# EasyEDA Pro project 轮腿PCB.eprj, schematic Schematic1
Board Name: 舵机电源板; Create Date: 2026-02-23
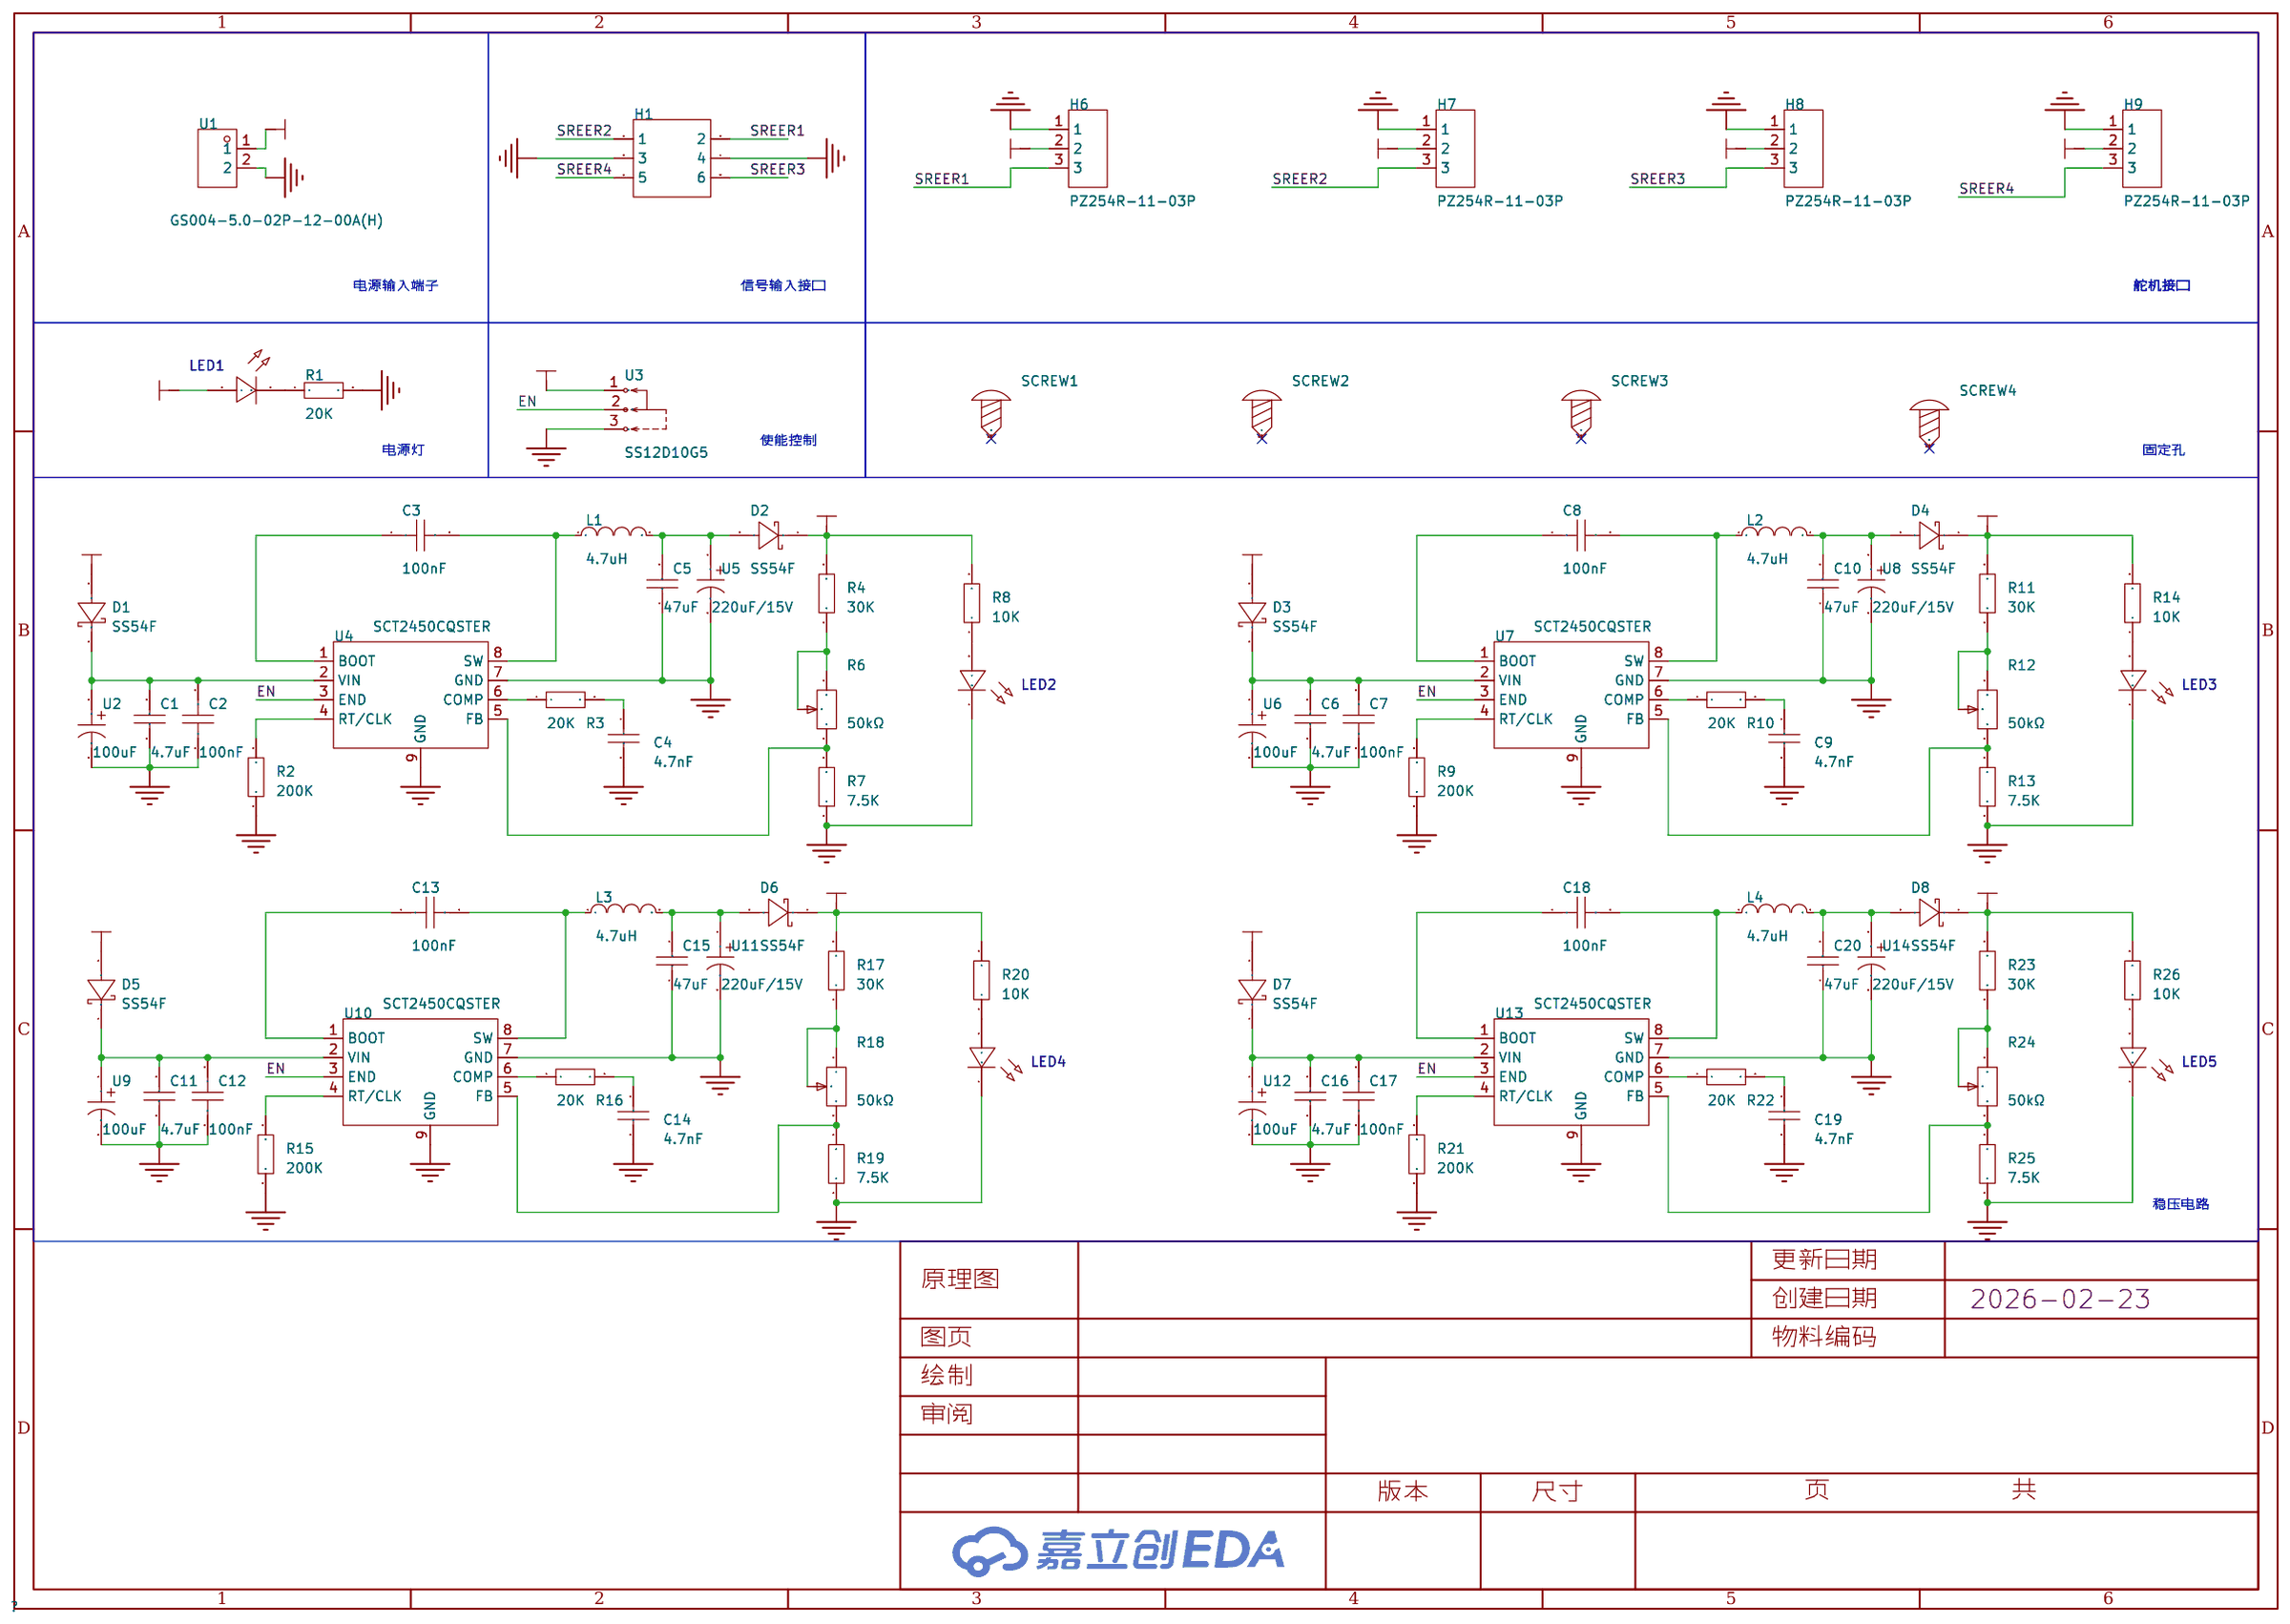
[diagram p0: schematic sheet]

## Parts
C1  4.7uF  [C1206]
C2  100nF  [C0603]
C3  100nF  [C0603]
C4  4.7nF  [C0603]
C5  47uF  [C0603]
C6  4.7uF  [C1206]
C7  100nF  [C0603]
C8  100nF  [C0603]
C9  4.7nF  [C0603]
C10  47uF  [C0603]
C11  4.7uF  [C1206]
C12  100nF  [C0603]
C13  100nF  [C0603]
C14  4.7nF  [C0603]
C15  47uF  [C0603]
C16  4.7uF  [C1206]
C17  100nF  [C0603]
C18  100nF  [C0603]
C19  4.7nF  [C0603]
C20  47uF  [C0603]
D1  SS54F  [SMAF_L3.5-W2.6-LS4.7-RD-1]
D2  SS54F  [SMAF_L3.5-W2.6-LS4.7-RD-1]
D3  SS54F  [SMAF_L3.5-W2.6-LS4.7-RD-1]
D4  SS54F  [SMAF_L3.5-W2.6-LS4.7-RD-1]
D5  SS54F  [SMAF_L3.5-W2.6-LS4.7-RD-1]
D6  SS54F  [SMAF_L3.5-W2.6-LS4.7-RD-1]
D7  SS54F  [SMAF_L3.5-W2.6-LS4.7-RD-1]
D8  SS54F  [SMAF_L3.5-W2.6-LS4.7-RD-1]
H1  -  [HDR-TH_6P-P2.54-V-R2-C3-S2.54_A2541WV-2X3P]
H6  PZ254R-11-03P  [HDR-TH_3P-P2.54-H-M-W10.4]
H7  PZ254R-11-03P  [HDR-TH_3P-P2.54-H-M-W10.4]
H8  PZ254R-11-03P  [HDR-TH_3P-P2.54-H-M-W10.4]
H9  PZ254R-11-03P  [HDR-TH_3P-P2.54-H-M-W10.4]
L1  4.7uH  [IND-SMD_L5.4-W5.2_FXL0530]
L2  4.7uH  [IND-SMD_L5.4-W5.2_FXL0530]
L3  4.7uH  [IND-SMD_L5.4-W5.2_FXL0530]
L4  4.7uH  [IND-SMD_L5.4-W5.2_FXL0530]
LED1  -  [LED_0603]
LED2  -  [LED_0603]
LED3  -  [LED_0603]
LED4  -  [LED_0603]
LED5  -  [LED_0603]
R1  20K  [R0603]
R2  200K  [R0603]
R3  20K  [R0603]
R4  30K  [R0603]
R6  50kΩ  [RES-ADJ-TH_3296W]
R7  7.5K  [R0603]
R8  10K  [R0603]
R9  200K  [R0603]
R10  20K  [R0603]
R11  30K  [R0603]
R12  50kΩ  [RES-ADJ-TH_3296W]
R13  7.5K  [R0603]
R14  10K  [R0603]
R15  200K  [R0603]
R16  20K  [R0603]
R17  30K  [R0603]
R18  50kΩ  [RES-ADJ-TH_3296W]
R19  7.5K  [R0603]
R20  10K  [R0603]
R21  200K  [R0603]
R22  20K  [R0603]
R23  30K  [R0603]
R24  50kΩ  [RES-ADJ-TH_3296W]
R25  7.5K  [R0603]
R26  10K  [R0603]
SCREW1  -  [M3螺丝]
SCREW2  -  [M3螺丝]
SCREW3  -  [M3螺丝]
SCREW4  -  [M3螺丝]
U1  GS004-5.0-02P-12-00A(H)  [CONN-TH_GS004-5.0-02P-12-00A-H]
U2  100uF  [CAP-SMD_BD6.3-L6.6-W6.6-LS7.2-FD-1]
U3  SS12D10G5  [SW-TH_SHOU-HAN_SS12D10G4]
U4  SCT2450CQSTER  [ESOP-8_L4.9-W3.9-P1.27-LS6.0-BL-EP]
U5  220uF/15V  [CAP-TH_BD6.3-P2.50-D0.6-FD-1]
U6  100uF  [CAP-SMD_BD6.3-L6.6-W6.6-LS7.2-FD-1]
U7  SCT2450CQSTER  [ESOP-8_L4.9-W3.9-P1.27-LS6.0-BL-EP]
U8  220uF/15V  [CAP-TH_BD6.3-P2.50-D0.6-FD-1]
U9  100uF  [CAP-SMD_BD6.3-L6.6-W6.6-LS7.2-FD-1]
U10  SCT2450CQSTER  [ESOP-8_L4.9-W3.9-P1.27-LS6.0-BL-EP]
U11  220uF/15V  [CAP-TH_BD6.3-P2.50-D0.6-FD-1]
U12  100uF  [CAP-SMD_BD6.3-L6.6-W6.6-LS7.2-FD-1]
U13  SCT2450CQSTER  [ESOP-8_L4.9-W3.9-P1.27-LS6.0-BL-EP]
U14  220uF/15V  [CAP-TH_BD6.3-P2.50-D0.6-FD-1]

## Library data of the parts
C1 C6 C11 C16 = 1206B475K500NT: 容值:4.7uF;精度:±10%;额定电压:50V;温度系数:X7R;; LCSC Part Name: 4.7uF ±10% 50V; Supplier Part: C29823; Manufacturer: FH(风华); Supplier Footprint: 1206; JLCPCB Part Class: 基础库; Datasheet: https://item.szlcsc.com/datasheet/1206B475K500NT/30577.html; Supplier: LCSC; Tolerance: ±10%; Voltage Rating: 50V; Temperature Coefficient: X7R
C2 C3 C7 C8 C12 C13 C17 C18 = CC0603KRX7R9BB104: 容值:100nF;精度:±10%;额定电压:50V;温度系数:X7R;; LCSC Part Name: 100nF ±10% 50V; Supplier Part: C14663; Manufacturer: YAGEO(国巨); Supplier Footprint: 0603; JLCPCB Part Class: 基础库; Datasheet: https://item.szlcsc.com/datasheet/CC0603KRX7R9BB104/15331.html; Supplier: LCSC; Tolerance: ±10%; Voltage Rating: 50V; Temperature Coefficient: X7R
C4 C9 C14 C19 = CL10B472KB8NNNC: 容值:4.7nF;精度:±10%;额定电压:50V;温度系数:X7R;; LCSC Part Name: 4.7nF ±10% 50V; Supplier Part: C1621; Manufacturer: SAMSUNG(三星); Supplier Footprint: 0603; Datasheet: https://item.szlcsc.com/datasheet/CL10B472KB8NNNC/1973.html; Supplier: LCSC; Tolerance: ±10%; Voltage Rating: 50V; Temperature Coefficient: X7R
C5 C10 C15 C20 = CL10A475KA8NQNC: 容值:4.7uF;精度:±10%;额定电压:25V;温度系数:X5R;; LCSC Part Name: 4.7uF ±10% 25V; Supplier Part: C69335; Manufacturer: SAMSUNG(三星); Supplier Footprint: 0603; Datasheet: https://item.szlcsc.com/datasheet/CL10A475KA8NQNC/70449.html; Supplier: LCSC; Tolerance: ±10%; Voltage Rating: 25V; Temperature Coefficient: X5R
D1-D8 = SS54F_C18199179: 二极管配置:独立式;正向压降(Vf):550mV@5.0A;直流反向耐压(Vr):40V;整流电流:5A;; LCSC Part Name: 电压:40V 电流:5A; Supplier Part: C18199179; Manufacturer: R+O(宏嘉诚); Supplier Footprint: SMAF; Datasheet: https://item.szlcsc.com/datasheet/SS54F/19354411.html; Supplier: LCSC; Diode Configuration: 独立式; Voltage - Forward(Vf@If): 550mV@5.0A; Voltage - DC Reverse(Vr): 40V; Current - Rectified: 5A; Reverse Leakage Current (Ir): 200uA@40V; Operating Junction Temperature Range: -55℃~+125℃; Non-Repetitive Peak Forward Surge Current: 120A
H1 = HDR-M_2.54_2x3: Supplier Part: C402781; Supplier Footprint: 插件,P=2.54mm
H6-H9 = PZ254R-11-03P: 插针结构:1x3P;间距:2.54mm;行距:-;圆针/方针:方针;安装方式:弯插;排数:单排;总PIN位数:3P;额定电流:-;额定电压:-;配合针长度:6mm;塑高:2.5mm;触头材质:黄铜;触头镀层:-;工作温度:-40℃~+105℃;颜色:黑色;; LCSC Part Name: 1x3P 间距:2.54mm 方针 弯插; Supplier Part: C492411; Manufacturer: XFCN(兴飞); Supplier Footprint: 弯插,P=2.54mm; JLCPCB Part Class: 扩展库; Datasheet: https://item.szlcsc.com/datasheet/PZ254R-11-03P/502967.html; Supplier: LCSC; Pin Structure: 1x3P; Pitch: 2.54mm; Circluar Pins/Square Pins: 方针; Mounting Type: 弯插; Number of Rows: 单排; Number of Pins: 3P; Length of Mating Pin: 6mm; Insulation Height: 2.5mm; Contact Material: 黄铜; Operating Temperature: -40℃~+105℃; Color: 黑色
L1-L4 = FXL0530-4R7-M: 电感值:4.7uH;精度:±20%;额定电流:4.5A;饱和电流(Isat):5A;类型:一体成型电感;; LCSC Part Name: 4.7uH ±20% 5A; Supplier Part: C177246; Manufacturer: cjiang(长江微电); Supplier Footprint: SMD,5.4x5.2mm; Datasheet: https://item.szlcsc.com/datasheet/FXL0530-4R7-M/188638.html; Supplier: LCSC; Tolerance: ±20%; Current Rating: 4.5A; Current - Saturation(Isat): 5A; DC Resistance(DCR): 60mΩ; Type: 一体成型电感
LED1-LED5 = LED_0603-B: Supplier Footprint: 0603
R1-R4 R7-R11 R13-R17 R19-R23 R25 R26 = Res_0603: Supplier Footprint: 0603
R6 R12 R18 R24 = 3296W-1-503LF_C49190466: 阻值:50kΩ;精度:±10%;功率:500mW;温度系数:±150ppm/℃;; LCSC Part Name: 3296W-1-503LF; Supplier Part: C49190466; Manufacturer: JIERR(捷而瑞); Manufacturer Part: 3296W-1-503LF; Supplier Footprint: 插件-3P,9.5x4.9mm; Datasheet: https://item.szlcsc.com/datasheet/3296W-1-503LF/51587059.html; Supplier: LCSC; Tolerance: ±10%; Power(Watts): 500mW; Temperature Coefficient: ±150ppm/℃; Number of Turns: 28
SCREW1-SCREW4 = M3螺丝: Supplier Footprint: 插件
U1 = GS004-5.0-02P-12-00A(H): LCSC Part Name: 螺钉式接线端子; Supplier Part: C5142593; Manufacturer: GOOSVN(高胜); Datasheet: https://item.szlcsc.com/datasheet/GS004-5.0-02P-12-00A(H)/5758995.html; Supplier: LCSC
U2 U6 U9 U12 = RVT1E101M0607 100UF 25V: 容值:100uF;精度:±20%;额定电压:25V;纹波电流:93mA@120Hz;等效串联电阻(ESR):-;; LCSC Part Name: 100uF ±20% 25V; Supplier Part: C970685; Manufacturer: DMBJ(振宝佳); Supplier Footprint: SMD,D6.3xL7.7mm; Datasheet: https://item.szlcsc.com/datasheet/RVT1E101M0607%2520100UF%252025V/1060413.html; Supplier: LCSC; Tolerance: ±20%; Voltage Rating: 25V; Ripple Current: 93mA@120Hz; Diameter: 6.3mm; Height - Seated (Max): 7.7mm; Lifetime: 2800hrs@105℃; Operating Temperature: -55℃~+105℃
U3 = SS12D10G5: 电路结构:单刀双掷;安装方式:直插;额定电流:2A;额定电压:125V;工作寿命:3千次;; LCSC Part Name: SS12D10G5-7.0; Supplier Part: C7431054; Manufacturer: SHOU HAN(首韩); Supplier Footprint: 插件,12.7x6.7mm; JLCPCB Part Class: 扩展库; Datasheet: https://item.szlcsc.com/datasheet/SS12D10G5/8431406.html; Supplier: LCSC; Circuit: 单刀双掷; Length: 12.7mm; Width: 6.7mm; Mounting Type: 直插; Current Rating: 2A; Voltage Rating: 125V; Life: 3千次; Operating Temperature: -25℃~+70℃
U4 U7 U10 U13 = SCT2450CQSTER: Supplier Part: C48971626; Supplier Footprint: ESOP-8; JLCPCB Part Class: 扩展库; Supplier: LCSC
U5 U8 U11 U14 = 220uF/15V: Supplier Part: C9900016171; Supplier Footprint: CAP6.3*8mm; JLCPCB Part Class: 扩展库; Supplier: LCSC

## Nets
GND: C1.1 C2.2 C4.2 C5.1 C6.1 C7.2 C9.2 C10.1 C11.1 C12.2 C14.2 C15.1 C16.1 C17.2 C19.2 C20.1 H1.3 H1.4 H6.1 H7.1 H8.1 H9.1 LED2.1(C) LED3.1(C) LED4.1(C) LED5.1(C) R1.2 R2.1 R7.1 R9.1 R13.1 R15.1 R19.1 R21.1 R25.1 U1.2 U2.2 U3.3 U4.7(GND) U4.9(GND) U5.2 U6.2 U7.7(GND) U7.9(GND) U8.2 U9.2 U10.7(GND) U10.9(GND) U11.2 U12.2 U13.7(GND) U13.9(GND) U14.2
VCCSREER1: D2.1(K) H6.2 R4.2 R8.2
VCCSREER2: D4.1(K) H7.2 R11.2 R14.2
VCCSREER3: D6.1(K) H8.2 R17.2 R20.2
VCCSREER4: D8.1(K) H9.2 R23.2 R26.2
VIN: D1.2(A) D3.2(A) D5.2(A) D7.2(A) LED1.2(A) U1.1 U3.1
EN: U3.2 U4.3(END) U7.3(END) U10.3(END) U13.3(END)
SREER1: H1.2 H6.3
SREER2: H1.1 H7.3
SREER3: H1.6 H8.3
SREER4: H1.5 H9.3
$1N1137: C1.2 C2.1 D1.1(K) U2.1 U4.2(VIN)
$1N1283: LED1.1(C) R1.1
$1N2088: R2.2 U4.4(RT/CLK)
$1N2223: C3.1 U4.1(BOOT)
$1N2417: C4.1 R3.2
$1N2458: C3.2 L1.1 U4.8(SW)
$1N2471: R3.1 U4.6(COMP)
$1N2543: C5.2 D2.2(A) L1.2 U5.1
$1N3084: R4.1 R6.1 R6.2
$1N3157: LED2.2(A) R8.1
$1N3217: R6.3 R7.2 U4.5(FB)
$1N3929: C6.2 C7.1 D3.1(K) U6.1 U7.2(VIN)
$1N3944: R9.2 U7.4(RT/CLK)
$1N3951: C8.1 U7.1(BOOT)
$1N3955: C9.1 R10.2
$1N3960: C8.2 L2.1 U7.8(SW)
$1N3965: R10.1 U7.6(COMP)
$1N3967: C10.2 D4.2(A) L2.2 U8.1
$1N3983: R11.1 R12.1 R12.2
$1N3988: LED3.2(A) R14.1
$1N3993: R12.3 R13.2 U7.5(FB)
$1N4688: C11.2 C12.1 D5.1(K) U9.1 U10.2(VIN)
$1N4703: R15.2 U10.4(RT/CLK)
$1N4710: C13.1 U10.1(BOOT)
$1N4714: C14.1 R16.2
$1N4719: C13.2 L3.1 U10.8(SW)
$1N4724: R16.1 U10.6(COMP)
$1N4726: C15.2 D6.2(A) L3.2 U11.1
$1N4742: R17.1 R18.1 R18.2
$1N4747: LED4.2(A) R20.1
$1N4752: R18.3 R19.2 U10.5(FB)
$1N5447: C16.2 C17.1 D7.1(K) U12.1 U13.2(VIN)
$1N5462: R21.2 U13.4(RT/CLK)
$1N5469: C18.1 U13.1(BOOT)
$1N5473: C19.1 R22.2
$1N5478: C18.2 L4.1 U13.8(SW)
$1N5483: R22.1 U13.6(COMP)
$1N5485: C20.2 D8.2(A) L4.2 U14.1
$1N5501: R23.1 R24.1 R24.2
$1N5506: LED5.2(A) R26.1
$1N5511: R24.3 R25.2 U13.5(FB)

Not connected (* = marked no-connect by the designer): SCREW1 1*; SCREW2 1*; SCREW3 1*; SCREW4 1*

## Notes on the sheet
- 电源输入端子
- 信号输入接口
- 舵机接口
- 舵机接口
- 电源灯
- 使能控制
- 固定孔
- 稳压电路
